# EAGLE design giraffe_bosch_comma (EAGLE 9.0.1)
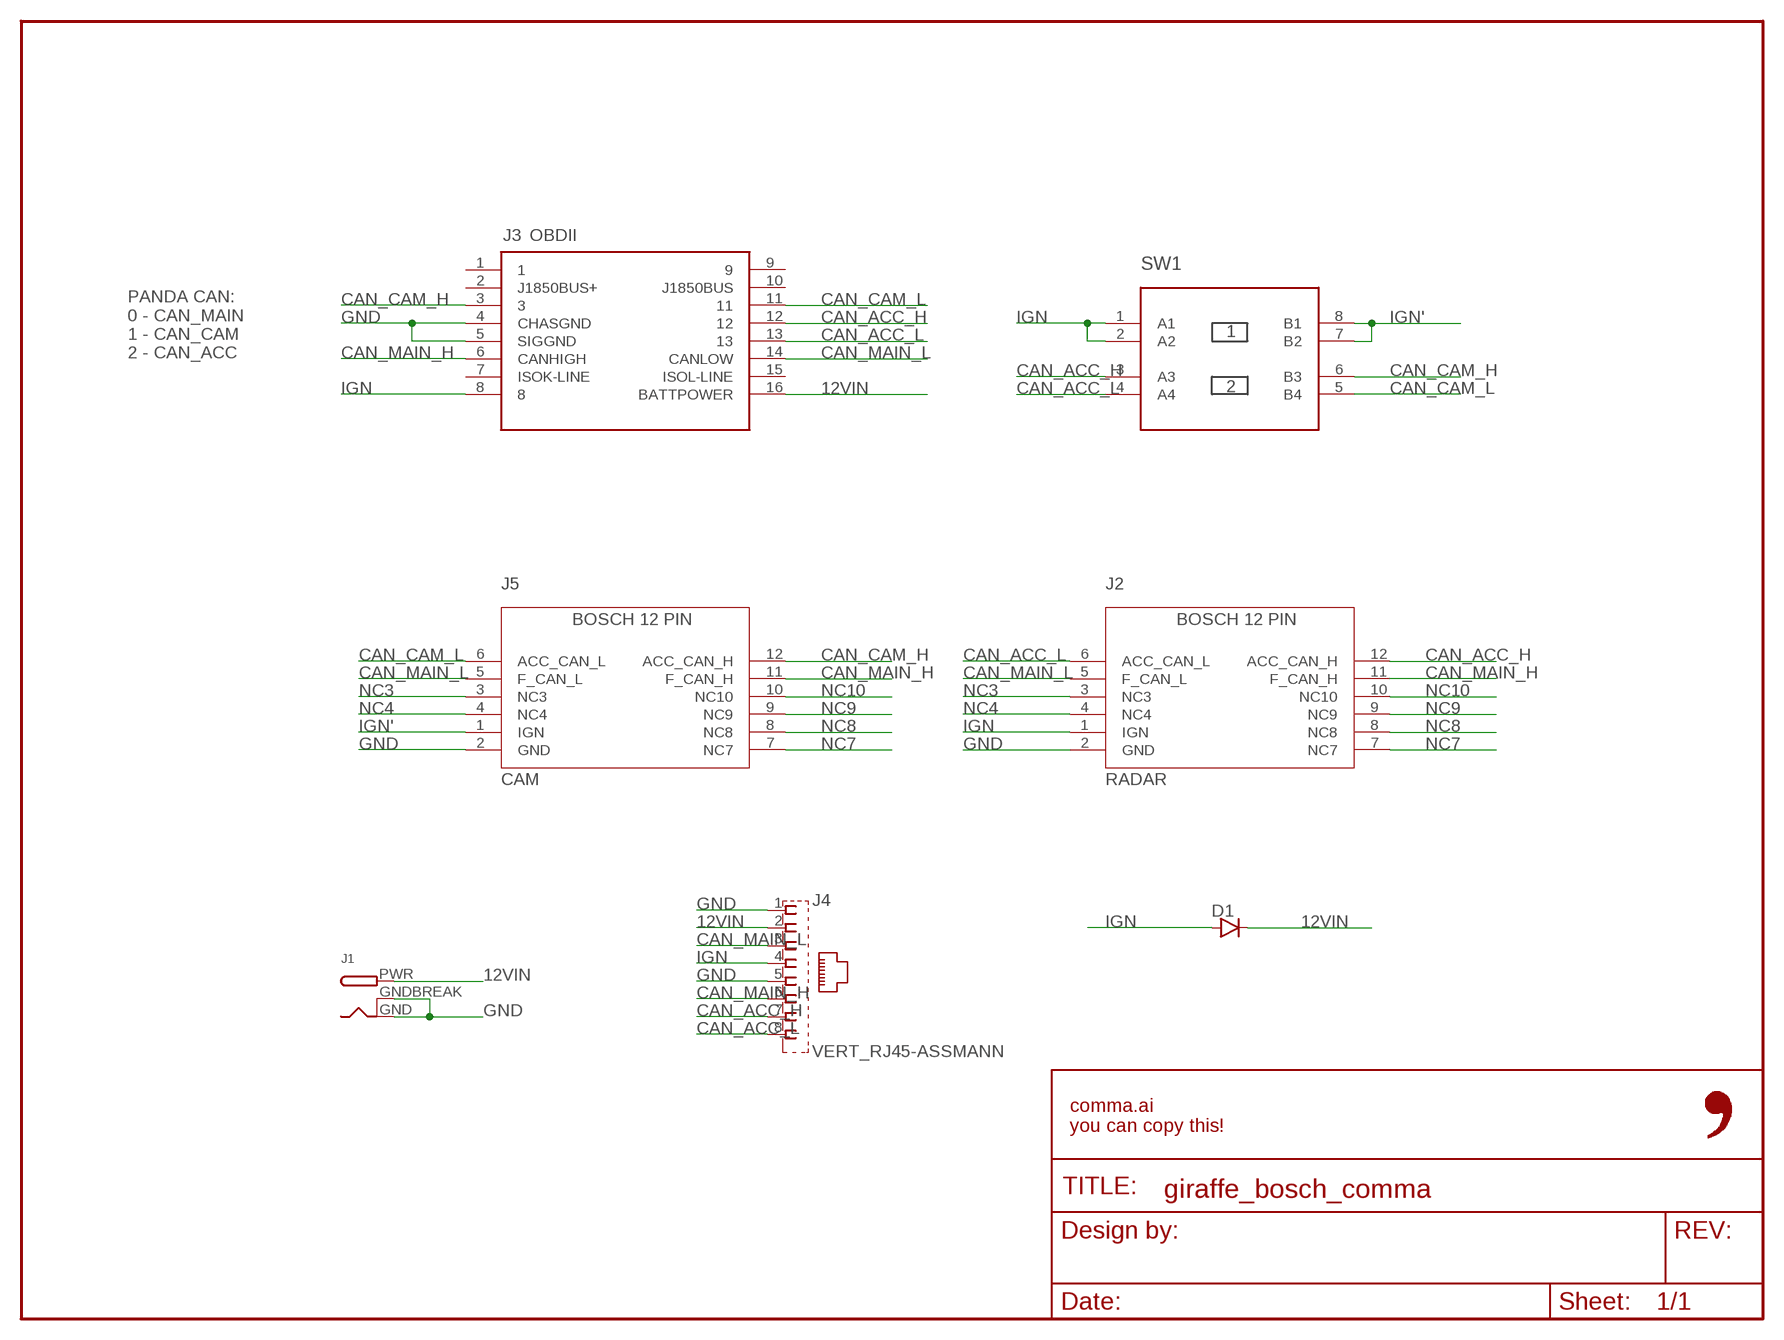
[diagram p0: schematic, sheet 1]

## Parts
D1  DIODE-  [DO-214]
FRAME1  FRAME-LETTER-OPENNO_PACKAGE  [DUMMY]
J1  DCBARRELPTH  [DCJACK_2MM_PTH]
J2  RADAR  BOSCH_12_PIN-F  [BOSCH_12_PIN_FEMALE]
J3  OBDII-FEMALE-CUT  [OBDII-FEMALE-MIDCUT]
J4  VERT_RJ45-ASSMANN  [RJ45-VERT]
J5  CAM  BOSCH_12_PIN-M  [BOSCH_12_PIN_MALE]
SW1  2XDPST-CTS  [2-DPST]

## Nets
12VIN [PWR]: D1.1(C) J1.PWR J3.16(BATTPOWER) J4.2
CAN_ACC_H [diff_pair]: J2.12(ACC_CAN_H) J3.12 J4.7 SW1.3(A3)
CAN_ACC_L [diff_pair]: J2.6(ACC_CAN_L) J3.13 J4.8 SW1.4(A4)
CAN_CAM_H [diff_pair]: J3.3 J5.12(ACC_CAN_H) SW1.6(B3)
CAN_CAM_L [diff_pair]: J3.11 J5.6(ACC_CAN_L) SW1.5(B4)
CAN_MAIN_H [diff_pair]: J2.11(F_CAN_H) J3.6(CANHIGH) J4.6 J5.11(F_CAN_H)
CAN_MAIN_L [diff_pair]: J2.5(F_CAN_L) J3.14(CANLOW) J4.3 J5.5(F_CAN_L)
GND: J1.GND J1.GNDBREAK J2.2(GND) J3.4(CHASGND) J3.5(SIGGND) J4.1 J4.5 J5.2(GND)
IGN [PWR]: D1.2(A) J2.1(IGN) J3.8 J4.4 SW1.1(A1) SW1.2(A2)
IGN': J5.1(IGN) SW1.7(B2) SW1.8(B1)
NC3: J2.3(NC3) J5.3(NC3)
NC4: J2.4(NC4) J5.4(NC4)
NC7: J2.7(NC7) J5.7(NC7)
NC8: J2.8(NC8) J5.8(NC8)
NC9: J2.9(NC9) J5.9(NC9)
NC10: J2.10(NC10) J5.10(NC10)
Unconnected: J3.1 J3.2(J1850BUS+) J3.7(ISOK-LINE) J3.9 J3.10(J1850BUS) J3.15(ISOL-LINE)

## Notes on the sheet
- OBDII
- PANDA CAN:
  0 - CAN_MAIN
  1 - CAN_CAM
  2 - CAN_ACC

## Library data of the parts
D1 = comma.ai:DIODE
FRAME1 = comma.ai:FRAME-LETTER-OPEN: Schematic Frame - Letter Standard 8.5x11 US Letter frame; DESIGNER: Nobody; VERSION: v01
J1 = comma.ai:DCBARREL: 2.0mm DC Barrel Jack DCJACK_2MM_PTH - Through Hole Jack (4UConnector: 05537)
J2 J5 = comma.ai:BOSCH_12_PIN
J3 = comma.ai:OBDII-FEMALE
J4 = comma.ai:VERT_RJ45: Mod. Jack, Right Angle, 8 posiotion, 8 contatcs RJ45 Source: GLX-S-88M.pdf
SW1 = comma.ai:2XDPST

## Net classes
1 PWR: clearance 0.381 mm
2 diff_pair: clearance 0.381 mm

## Board
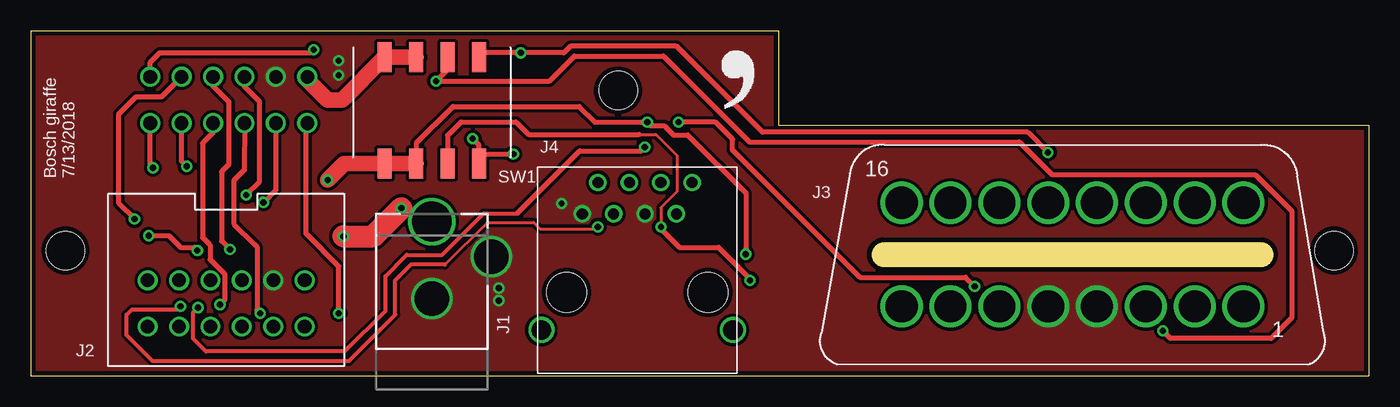
[diagram p1: board, top side]
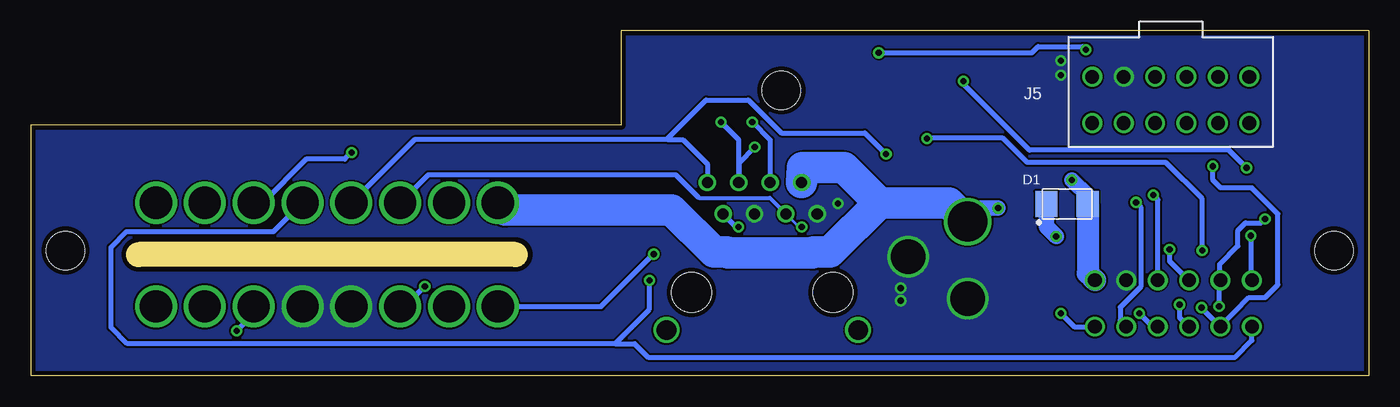
[diagram p2: board, bottom side, seen from below]

Size 108.2 x 27.94 mm. Coordinates in mm from the lower left corner, seen from the top.
Outline: 69.01,9.83 99.49,9.83
Outline: 0,27.94 60.45,27.94 60.45,20.32 108.2,20.32 108.2,0 0,0 0,27.94
Copper layers (1*16): Top 0.035559375mm / dielectric 1.6mm / Bottom 0.035559375mm
Design rules "oshpark-2layer *": minimum track width 6mil, minimum drill 19mil, track to track 6mil, track to pad 6mil, pad to pad 6mil, via to via 6mil, smd to smd 6mil, copper to edge 15mil, drill to drill 6mil, minimum pad ring 10mil, minimum via ring 8mil, stop-mask expansion 2.5mil, vias tented up to drill 0mil, thermal gap 10mil
Holes 3.1 mm at 47.5,23.11 105.41,10.16 2.79,10.16
tKeepout: area -0.3,30.5 to 60.7,31.8; area -0.3,-1.3 to 1,30.5; area -0.3,-1.3 to 101.3,1.3; area 100.1,-1.3 to 102.6,20.3; area 58.2,17.8 to 102.6,31.8
bKeepout: area -0.3,30.5 to 60.7,31.8; area -0.3,-1.3 to 1,30.5; area -0.3,-1.3 to 102.6,1.3; area 100.1,-1.3 to 102.6,20.3; area 58.2,17.8 to 102.6,20.3; area 58.2,17.8 to 60.7,31.8; area 1,30.5 to 60.7,31.8

### Footprints (pad centres in the part's own frame; a part is rotated, then mirrored left to right if it is on the bottom)
DO-214 = smd 1.8 x 2.1: 1 -1.7,0; 2 1.65,0
DCJACK_2MM_PTH = drill 2.8: GND 0,7.35; GNDBREAK 4.8,10.75 | drill 3.2: PWR 0,13.6
BOSCH_12_PIN_FEMALE = drill 1.1: 1 6.35,1.875; 2 3.81,1.875; 3 1.27,1.875; 4 -1.27,1.875; 5 -3.81,1.875; 6 -6.35,1.875; 7 6.35,-1.875; 8 3.81,-1.875; 9 1.27,-1.875; 10 -1.27,-1.875; 11 -3.81,-1.875; 12 -6.35,-1.875
OBDII-FEMALE-MIDCUT = drill 2.6 pad 3.4: 1 13.825,-4.2; 2 9.875,-4.2; 3 5.925,-4.2; 4 1.975,-4.2; 5 -1.975,-4.2; 6 -5.925,-4.2; 7 -9.875,-4.2; 8 -13.825,-4.2; 9 13.825,4.2; 10 9.875,4.2; 11 5.925,4.2; 12 1.975,4.2; 13 -1.975,4.2; 14 -5.925,4.2; 15 -9.875,4.2; 16 -13.825,4.2
RJ45-VERT = drill 0.9: 1 -4.445,6.35; 2 -3.175,8.89; 3 -1.905,6.35; 4 -0.635,8.89; 5 0.635,6.35; 6 1.905,8.89; 7 3.175,6.35; 8 4.445,8.89 | drill 1.6: P$1 -7.75,-3.05; P$2 7.75,-3.05 | hole 3.2: -5.715,0; 5.715,0
BOSCH_12_PIN_MALE = drill 1.1: 1 -6.35,1.875; 2 -3.81,1.875; 3 -1.27,1.875; 4 1.27,1.875; 5 3.81,1.875; 6 6.35,1.875; 7 -6.35,-1.875; 8 -3.81,-1.875; 9 -1.27,-1.875; 10 1.27,-1.875; 11 3.81,-1.875; 12 6.35,-1.875
2-DPST = smd 1.13 x 2.44: 1 -3.81,-4.3; 2 -1.27,-4.3; 3 1.27,-4.3; 4 3.81,-4.3; 5 3.81,4.3; 6 1.27,4.3; 7 -1.27,4.3; 8 -3.81,4.3

### Placement (x,y rotation side)
D1  24.37,13.92 0 bottom
FRAME1  -0.25,-26.67 0 top  (outside the outline)
J1  32.43,-1.09 0 top
J2  15.79,5.87 0 top
J3  84.26,9.82 0 top
J4  49.04,6.77 0 top
J5  16,22.35 0 bottom
SW1  32.43,21.5 0 top
U$1  [LOGO]  55.22,21.36 0 top

### Tracks (layer width: path | path; a pad name or v marks a point on that pad's centre or on a via)
12VIN  (via drill 0.5)
  Top 1.778: v25.27,11.3 27.69,11.3 v29.97,13.59
  Bottom 1.27: D1.1 26.07,12.1 v25.27,11.3 | v29.97,13.59 31.35,13.59 J1.PWR
  Bottom 1.778: J1.PWR 32.4,12.51
  Bottom 2.54: J1.PWR 33.95,14.03 39.59,14.03 | J3.16 69.85,13.44 56.37,13.44 52.97,10.03 51.91,10.03 51.83,9.96 44.98,9.96 44.9,10.03 43.58,10.03 39.59,14.03 | 39.59,14.03 42.43,16.87 45.81,16.87 J4.2
CAN_ACC_H  (via drill 0.5)
  Top 0.254: 49.21,19.56 50.55,19.56 52.27,17.83 52.27,14.94 50.96,13.62 v50.96,12.06
  Top 0.406: SW1.3 33.7,19.48 34.8,20.57 39.24,20.57 40.26,19.56 49.21,19.56 49.23,19.58 | v50.96,12.06 50.96,11.9 52.45,10.41 55.63,10.41 58.17,7.87 v58.17,7.75
  Bottom 0.406: 60.96,2.61 59.38,2.61 58.29,1.52 10.79,1.52 9.44,2.88 J2.12 | J4.7 51.16,12.06 v50.96,12.06 | v58.17,7.75 58.17,5.4 60.96,2.61 | 60.96,2.61 100.4,2.61 101.73,3.94 101.73,10.41 100.46,11.68 88.58,11.68 J3.12
CAN_ACC_L  (via drill 0.5)
  Top 0.406: v13.46,10.16 13.21,10.41 12.1,10.41 11.15,11.36 v9.53,11.36 | v39.03,17.97 36.65,17.97 36.24,17.56 SW1.4 36.24,18.7 v35.73,19.21
  Bottom 0.406: v9.53,11.36 9.53,7.76 J2.6 | v13.46,10.16 13.46,14.35 16.4,17.29 27.6,17.29 29.56,19.25 35.7,19.25 v35.73,19.21 | 56.64,19.14 55.46,19.14 53.49,17.16 J4.8 | v39.03,17.97 40.75,19.68 47.5,19.68 50.16,22.35 53.59,22.35 56.64,19.3 56.64,19.14 | 56.64,19.14 77.18,19.14 J3.13
CAN_CAM_H  (via drill 0.5)
  Top 0.406: 9.75,16.97 v9.87,16.85 9.65,17.07 J5.12 | SW1.6 33.7,24.81 v32.77,23.88 41.94,23.88 43.97,25.91 51.15,25.91 58.11,18.95 79.96,18.95 82.6,16.31 99.03,16.31 101.98,13.36 101.98,4.7 100.33,3.05 92.18,3.05 v91.57,3.66
  Bottom 0.406: v9.87,16.85 11.3,18.29 27.43,18.29 32.77,23.62 v32.77,23.88 | J3.3 90.19,5.04 v91.57,3.66
CAN_CAM_L  (via drill 0.5)
  Top 0.406: v82.27,18.1 80.64,19.74 59.18,19.74 52.22,26.7 43.65,26.7 43.11,26.16 v39.62,26.16 36.6,26.16 SW1.5 | J5.6 9.65,25.4 10.41,26.16 22.61,26.16 v22.86,26.42
  Bottom 0.406: v39.62,26.16 27.24,26.16 26.73,26.67 23.11,26.67 v22.86,26.42 | v82.27,18.1 82.83,17.55 85.95,17.55 89.47,14.03 J3.11
CAN_MAIN_H  (via drill 0.5)
  Top 0.305: 39.32,13.16 36.63,13.16 33.28,9.8 30.41,9.8 28.68,8.07 28.68,5.28 25.38,1.98 14.15,1.98 13.13,3 13.13,5.16 v13.51,5.54
  Top 0.406: v76.34,7.25 75.59,8 67.06,8 56.77,18.29 56.77,19.18 55.39,20.55 v52.39,20.55 | v49.66,18.54 49.33,18.22 44.38,18.22 39.32,13.16 | J5.11 12.19,17.38 v12.59,16.98
  Bottom 0.406: v52.39,20.55 50.95,19.11 J4.6 50.95,17.25 v49.66,18.54 | v12.59,16.98 12.59,15.85 11.97,15.23 9.44,15.23 7.34,13.13 7.34,7.39 8.38,6.36 9.68,6.36 J2.11 13.51,5.53 v13.51,5.54 | v76.34,7.25 77.97,5.62 J3.6
CAN_MAIN_L  (via drill 0.5)
  Top 0.254: 33.5,9.02 36.93,12.45 40.64,12.45 41.18,11.91 45.69,11.91 v45.85,12.06
  Top 0.305: v12.1,5.63 11.85,5.38 8.18,5.38 7.75,4.95 7.75,3.3 9.86,1.19 25.7,1.19 29.46,4.95 29.46,7.75 30.73,9.02 33.5,9.02
  Top 0.406: 8.36,12.72 v8.38,12.7 7.11,13.97 7.11,21.21 8.51,22.61 10.57,22.61 J5.5
  Bottom 0.254: J4.3 46.08,12.06 v45.85,12.06
  Bottom 0.305: J4.3 48.44,14.42 54.17,14.42 54.23,14.48
  Bottom 0.406: v8.38,12.7 8.69,12.39 9.96,12.39 10.56,11.79 10.56,10.52 12.04,9.04 J2.5 12.1,7.69 v12.1,5.63 | J3.14 76.05,16.31 56.06,16.31 54.23,14.48
GND  (via drill 0.5)
  other vias: 37.85,7.11 24.89,25.52 24.89,24.35 42.93,13.97 37.85,6.1
  pour Bottom (no thermals): 0,27.94 60.45,27.94 60.45,20.32 108.2,20.32 108.2,0 0,0
  pour Top (isolate 0.254, no thermals): 0,27.94 60.45,27.94 60.45,20.32 108.2,20.32 108.2,0 0,0
IGN  (via drill 0.5)
  Top 0.406: 49.85,20.76 v49.85,20.55 | SW1.2 31.16,18.84 34.14,21.82 44.34,21.82 45.61,20.55 v49.85,20.55 | v57.83,9.86 57.83,14.82 53.13,19.52 51.96,19.52 51.36,20.12 51.36,20.14 51.23,20.27 50.14,20.27 v49.85,20.55
  Top 1.27: SW1.2 SW1.1 25.33,17.2 v24,15.88 24.15,16.02
  Bottom 0.406: v49.85,20.55 48.41,19.11 J4.4 | J3.8 62.07,5.62 v57.83,9.86
  Bottom 1.27: D1.2 22.72,14.59 v24,15.88
  Bottom 1.778: J2.1 22.72,8.32 D1.2
IGN'
  Top 1.27: J5.1 22.35,24 24,22.35 25.17,22.35 SW1.8 | 26.67,23.85 SW1.8 | SW1.7 SW1.8
NC3  (via drill 0.5)
  Top 0.406: v17.42,14.65 18.49,15.72 18.49,22.23 17.25,23.46 J5.3
  Bottom 0.406: v17.42,14.65 17.04,14.27 J2.3
NC4  (via drill 0.5)
  Top 0.406: v16.09,10.25 15.41,10.93 15.41,16.54 16.03,17.16 16.03,22.18 14.73,23.48 J5.4
  Bottom 0.406: J2.4 16.09,9.29 v16.09,10.25
NC7  (via drill 0.5)
  Top 0.406: v24.89,5.08 24.89,8.88 22.25,11.52 22.25,20.38 J5.7
  Bottom 0.406: v24.89,5.08 23.81,4 J2.7
NC8  (via drill 0.5)
  Top 0.406: J5.8 19.81,15.06 v18.81,14.06
  Bottom 0.406: J2.8 20.09,4.54 20.09,5.56 18.38,7.26 18.38,13.63 v18.81,14.06
NC9  (via drill 0.5)
  Top 0.406: J5.9 17.25,16.67 16.41,15.83 16.41,12.31 18.04,10.68 18.2,10.52 18.29,10.43 18.29,5.33 v18.54,5.08
  Bottom 0.406: J2.9 17.46,4 v18.54,5.08
NC10  (via drill 0.5)
  Top 0.406: v15.29,5.78 15.7,6.19 15.7,8.22 14.5,9.43 14.5,10.59 13.89,11.2 13.89,18.86 14.75,19.71 J5.10
  Bottom 0.406: v15.29,5.78 15.29,4.75 J2.10

### Text on the board
tPlace: Bosch giraffe / 7/13/2018
Document: *compatible with freeTheC pins soldered on TOP